# EAGLE design PCB ERC - Control (3-7) (EAGLE 9.7.0)

## Sheet 1 of 2
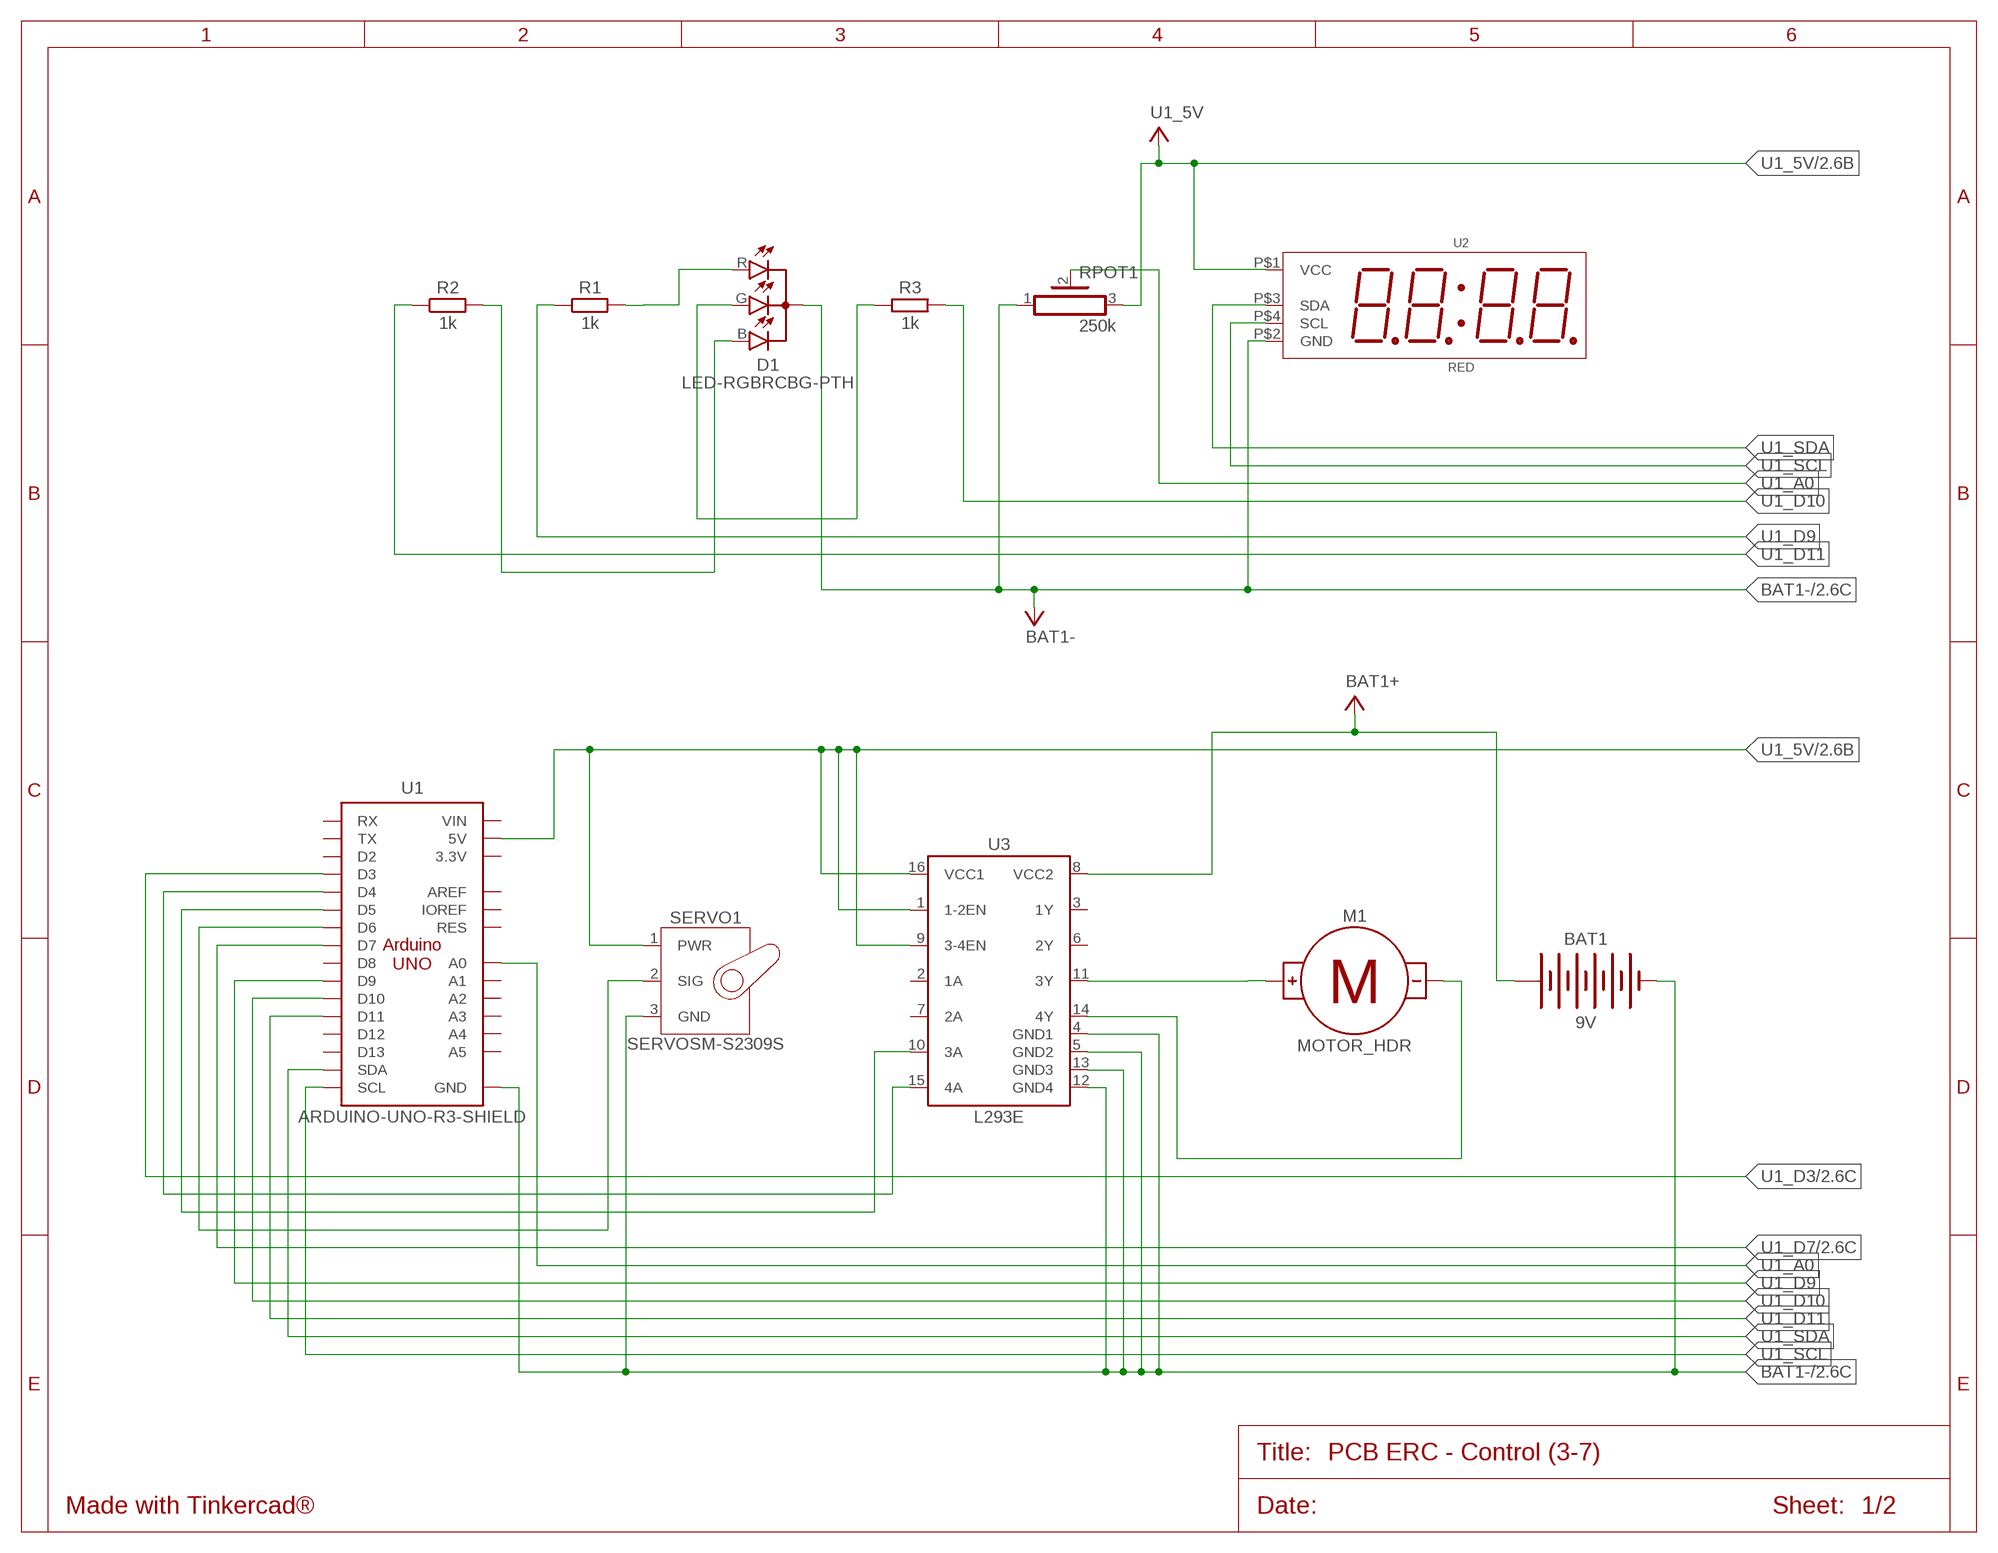
[diagram p0: schematic, sheet 1]

### Parts
BAT1  9V  BATTERY-9VGENERIC  [BATTERY-GENERIC]
D1  LED-RGBRCBG-PTH  [LED-RGB-5MM]
M1  MOTOR_HDR  [MOTOR]
R1  1k  RESISTOR_AXIAL-10.16MM-PITCH  [RESAD1016W63L850D250B]
R2  1k  RESISTOR_AXIAL-10.16MM-PITCH  [RESAD1016W63L850D250B]
R3  1k  RESISTOR_AXIAL-10.16MM-PITCH  [RESAD1016W63L850D250B]
RPOT1  250k  POT_HA-06  [HA-06-SM065]
SERVO1  SERVOSM-S2309S  [SM-S2309S]
U1  ARDUINO-UNO-R3-SHIELD  [ARDUINO-UNO-R3-SHIELD]
U2  RED  7SEG-X4-I2C  [7SEG-X4-I2C]
U3  L293E  [DIP762W53P254L1969H508Q16B]

### Nets
BAT1+: BAT1.+ U3.8(VCC2)
BAT1-: BAT1.- D1.C RPOT1.1 SERVO1.3(GND) U1.GND@0(GND) U1.GND@1(GND) U1.GND@2(GND) U2.P$2(GND) U3.4(GND1) U3.5(GND2) U3.12(GND4) U3.13(GND3) ; also sheet 2
D1_B: D1.B R2.2
D1_G: D1.G R3.2
D1_R: D1.R R1.2
M1_+: M1.+ U3.11(3Y)
M1_-: M1.- U3.14(4Y)
U1_5V: RPOT1.3 SERVO1.1(PWR) U1.5V U2.P$1(VCC) U3.1(1-2EN) U3.9(3-4EN) U3.16(VCC1) ; also sheet 2
U1_A0: RPOT1.2 U1.A0
U1_D3: U1.D3 ; also sheet 2
U1_D4: U1.D4 U3.15(4A)
U1_D5: U1.D5 U3.10(3A)
U1_D6: SERVO1.2(SIG) U1.D6
U1_D7: U1.D7 ; also sheet 2
U1_D9: R1.1 U1.D9
U1_D10: R3.1 U1.D10
U1_D11: R2.1 U1.D11
U1_SCL: U1.SCL U2.P$4(SCL)
U1_SDA: U1.SDA U2.P$3(SDA)
Unconnected: U1.3.3V U1.A1 U1.A2 U1.A3 U1.A4 U1.A5 U1.AREF U1.D2 U1.D8 U1.D12 U1.D13 U1.IOREF U1.RES U1.RX U1.TX U1.VIN U3.2(1A) U3.3(1Y) U3.6(2Y) U3.7(2A)

## Sheet 2 of 2
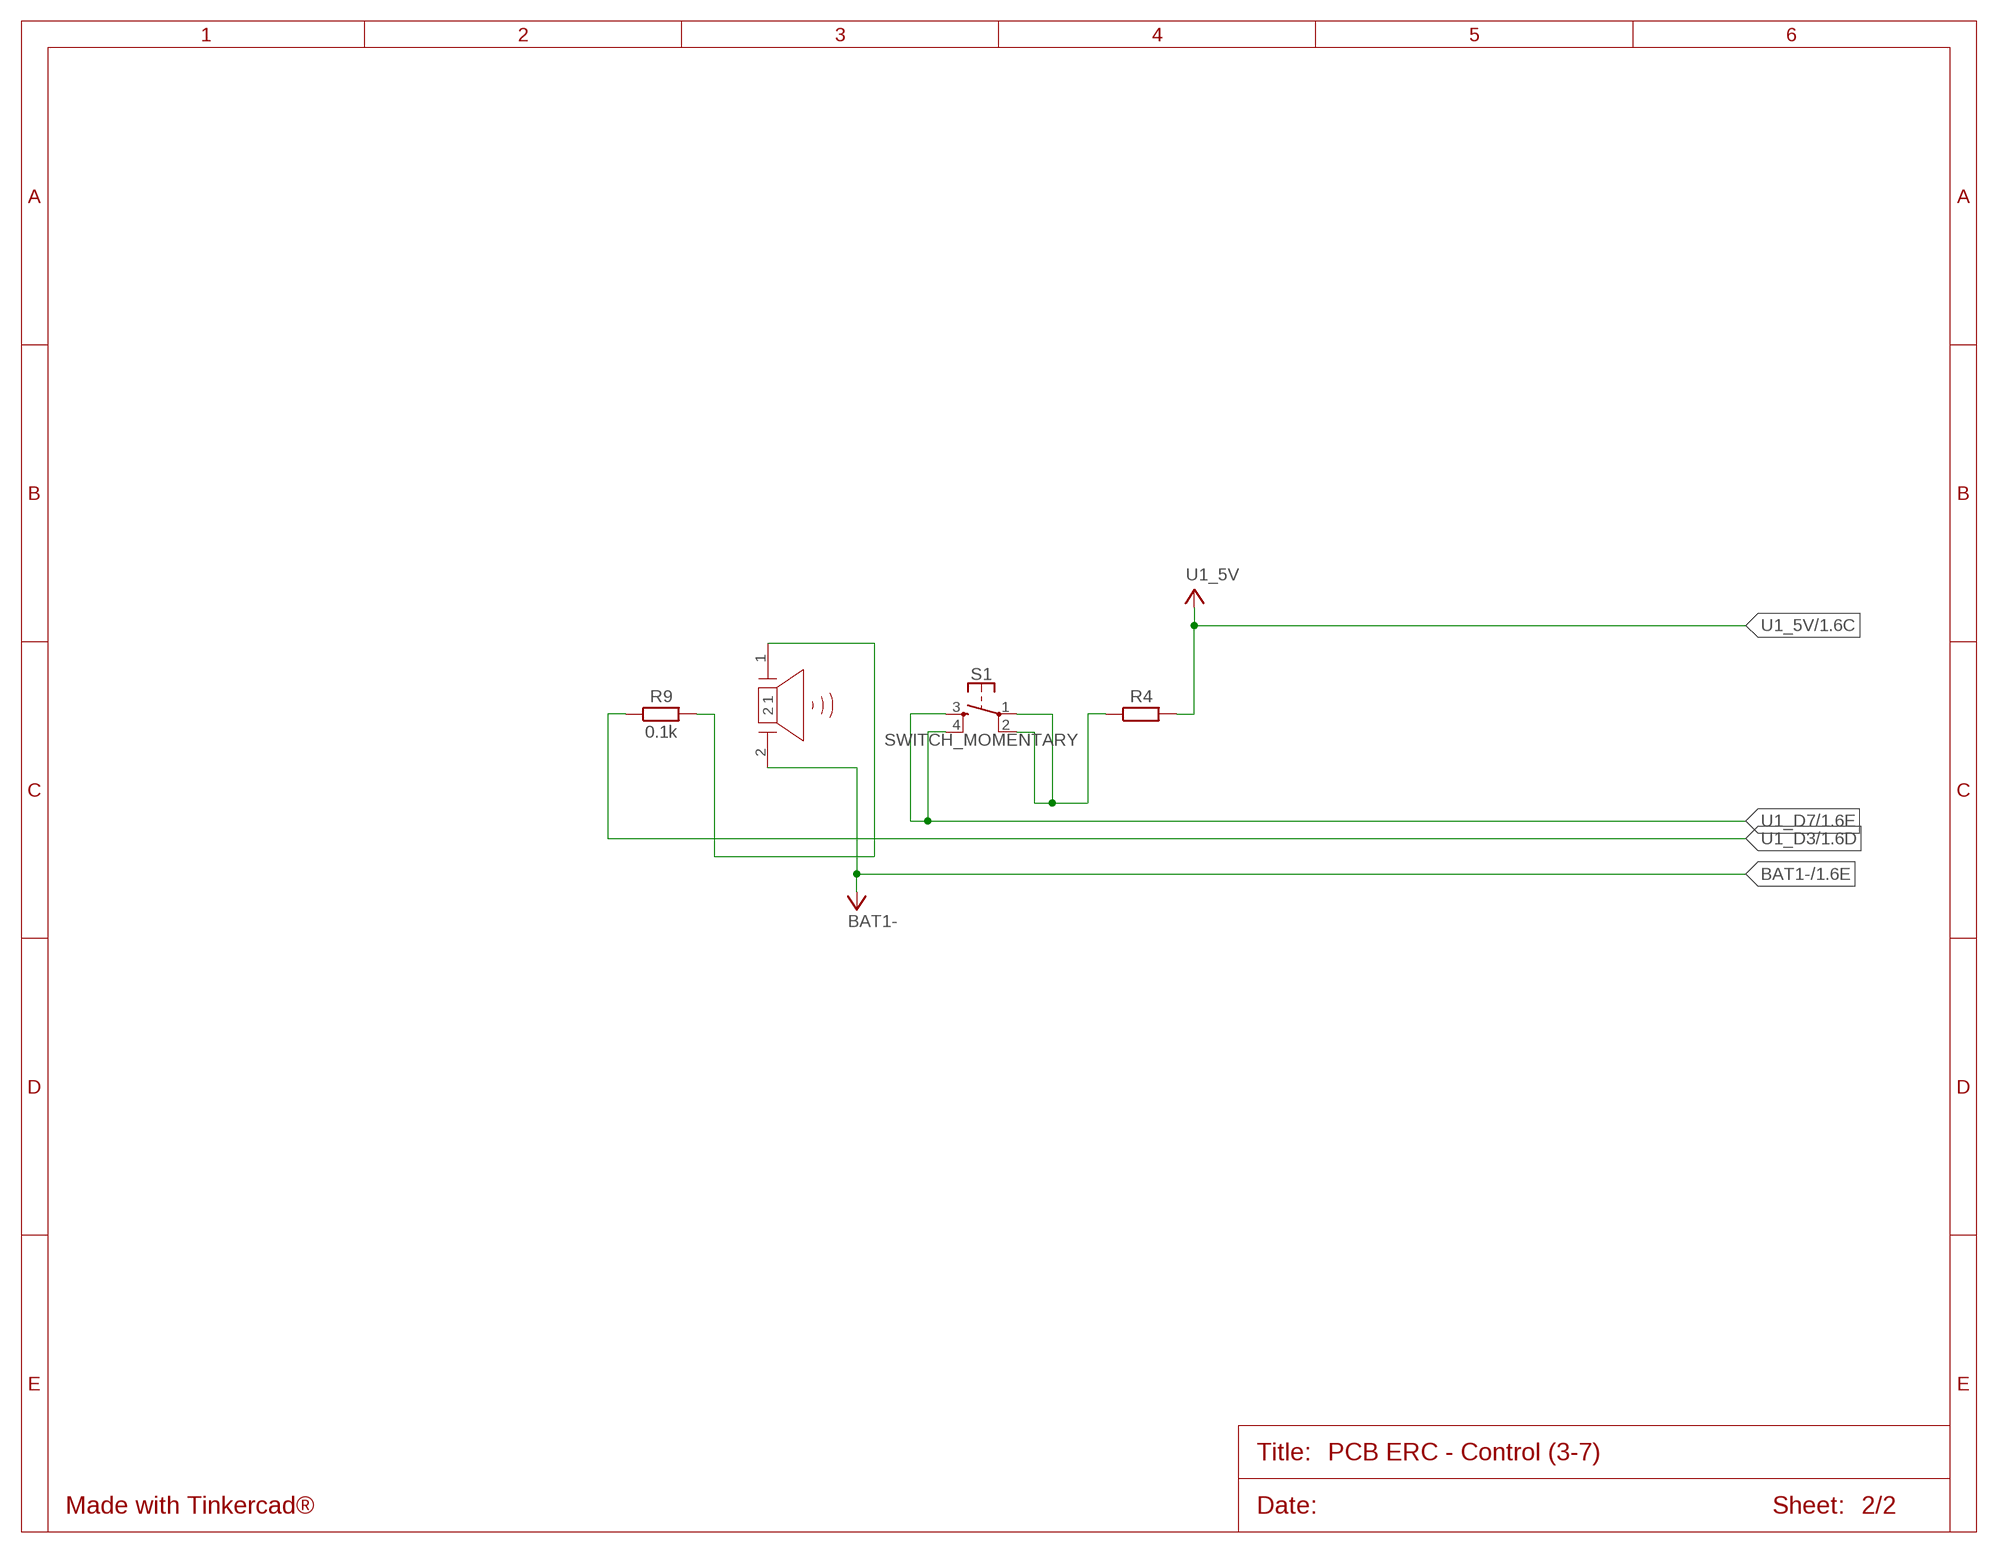
[diagram p1: schematic, sheet 2]

### Parts
PIEZO1  PIEZO  [PIEZO]
R4  RESISTOR_AXIAL-10.16MM-PITCH  [RESAD1016W63L850D250B]
R9  0.1k  RESISTOR_AXIAL-10.16MM-PITCH  [RESAD1016W63L850D250B]
S1  SWITCH_MOMENTARY  [SWITCH-MOMENTARY-PTH-6.5MM]

### Nets
BAT1-: PIEZO1.2 ; also sheet 1
PIEZO1_1: PIEZO1.1 R9.2
S1_1: R4.1 S1.1 S1.2
U1_5V: R4.2 ; also sheet 1
U1_D3: R9.1 ; also sheet 1
U1_D7: S1.3 S1.4 ; also sheet 1

## Library data of the parts
BAT1 = Tinkercad:BATTERY-9V
D1 = Tinkercad:LED-RGB
M1 = Tinkercad:MOTOR
PIEZO1 = Tinkercad:PIEZO: Piezoelectric Sounders / Buzzers Reference Datasheet <https://www.murata.com/products/productdata/8801054621726/SPEC-PKM17EPPH4001-B0.pdf?1517839212000>
R1-R4 R9 = Tinkercad:RESISTOR: Resistor Fixed - Generic
RPOT1 = Tinkercad:POT: Rectangular Trimmer Potentiometers - PV36 Series Datasheet <https://www.bourns.com/docs/Product-Datasheets/pv36.pdf>
S1 = Tinkercad:SWITCH_MOMENTARY
SERVO1 = Tinkercad:SERVO
U1 = Tinkercad:ARDUINO-UNO-R3-SHIELD
U2 = Tinkercad:7SEG-X4-I2C
U3 = Tinkercad:L293E: L293D H-bridge motor driver Datasheet <https://www.ti.com/lit/ds/symlink/l293.pdf>

## Board
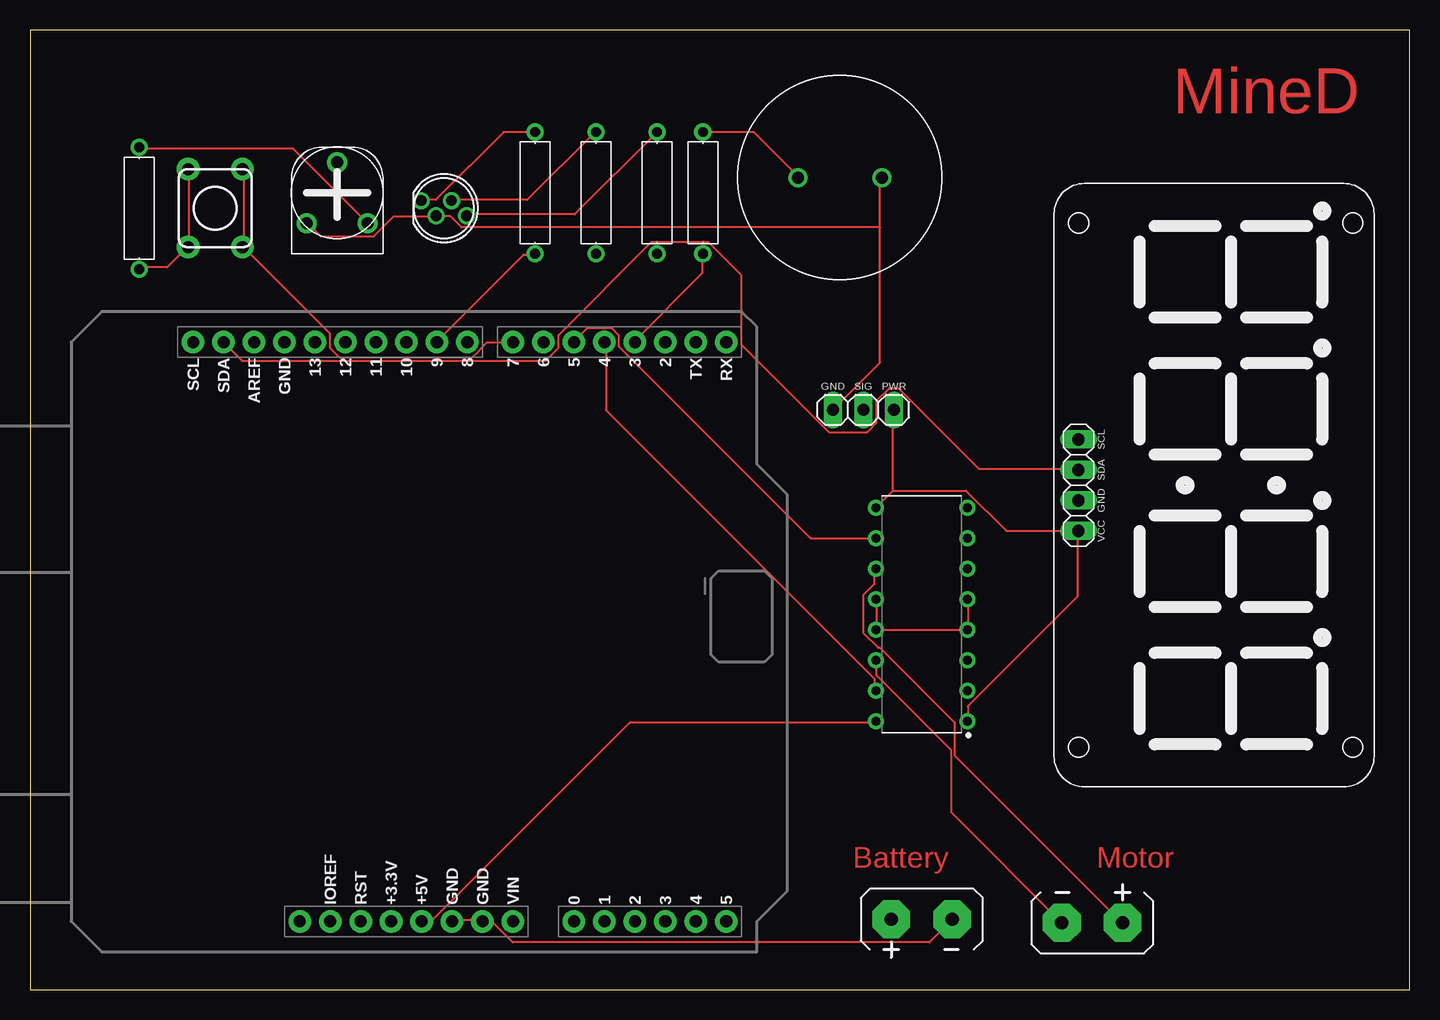
[diagram p2: board, top side]
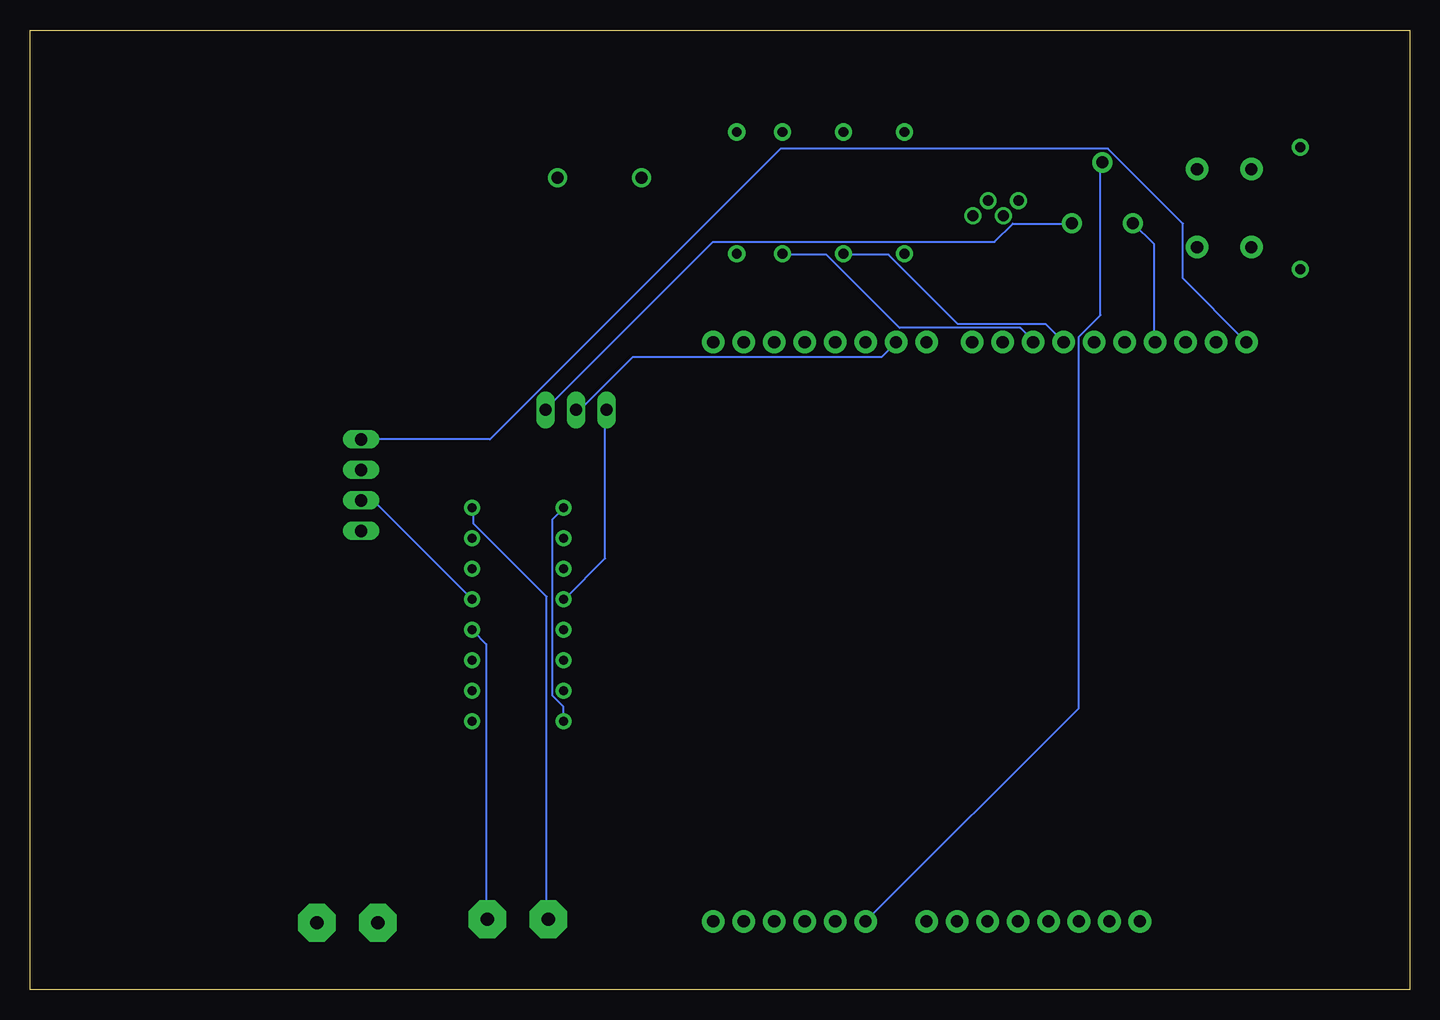
[diagram p3: board, bottom side, seen from below]

Size 115 x 79.99 mm. Coordinates in mm from the lower left corner, seen from the top.
Outline: 0,0 115,0 115,79.99 0,79.99 0,0
Copper layers (1*16): Top / Bottom
Stack-up Default Layer Stack: Top User Defined 0.035mm / Dielectric-1 User Defined 1.5mm / Bottom User Defined 0.035mm
Design rules "default": minimum track width 6mil, minimum drill 0.35mm, track to track 6mil, track to pad 6mil, pad to pad 6mil, via to via 6mil, smd to smd 6mil, copper to edge 40mil, drill to drill 6mil, minimum pad ring 10mil, minimum via ring 8mil, stop-mask expansion 4mil, vias tented up to drill 0mil, thermal gap 10mil

### Footprints (pad centres in the part's own frame; a part is rotated, then mirrored left to right if it is on the bottom)
BATTERY-GENERIC = drill 1.118 pad 3.15 octagon: + 2.54,0; - -2.54,0
LED-RGB-5MM = drill 0.9: B 0.635,0.635; C -0.635,-0.635; G 1.905,-0.635; R -1.905,0.635
MOTOR = drill 1.118 pad 3.15 octagon: + 2.54,0; - -2.54,0
PIEZO = drill 1 pad 1.6: 1 -3.5,0; 2 3.5,0
RESAD1016W63L850D250B = drill 0.83 pad 1.43: 1 -5.08,0; 2 5.08,0
HA-06-SM065 = drill 1 pad 1.676: 1 -2.54,-2.54; 2 0,2.54; 3 2.54,-2.54
SWITCH-MOMENTARY-PTH-6.5MM = drill 1.016 pad 1.88: 1 -3.251,2.261; 2 3.251,2.261; 3 -3.251,-2.261; 4 3.251,-2.261
SM-S2309S = drill 1.016 long: 1 -2.54,0; 2 0,0; 3 2.54,0
ARDUINO-UNO-R3-SHIELD = drill 1.016 pad 1.88: 3.3V 24.13,-2.54; 5V 24.13,0; A0 24.13,12.7; A1 24.13,15.24; A2 24.13,17.78; A3 24.13,20.32; A4 24.13,22.86; A5 24.13,25.4; AREF -24.13,-13.97; D2 -24.13,20.32; D3 -24.13,17.78; D4 -24.13,15.24; D5 -24.13,12.7; D6 -24.13,10.16; D7 -24.13,7.62; D8 -24.13,3.81; D9 -24.13,1.27; D10 -24.13,-1.27; D11 -24.13,-3.81; D12 -24.13,-6.35; D13 -24.13,-8.89; GND@0 24.13,2.54; GND@1 24.13,5.08; GND@2 -24.13,-11.43; IOREF 24.13,-7.62; NC 24.13,-10.16; RES 24.13,-5.08; RX -24.13,25.4; SCL -24.13,-19.05; SDA -24.13,-16.51; TX -24.13,22.86; VIN 24.13,7.62
7SEG-X4-I2C = drill 1.016 long: P$1 -3.81,0; P$2 -1.27,0; P$3 1.27,0; P$4 3.81,0
DIP762W53P254L1969H508Q16B = drill 0.743 pad 1.343: 1 -3.81,8.89; 2 -3.81,6.35; 3 -3.81,3.81; 4 -3.81,1.27; 5 -3.81,-1.27; 6 -3.81,-3.81; 7 -3.81,-6.35; 8 -3.81,-8.89; 9 3.81,-8.89; 10 3.81,-6.35; 11 3.81,-3.81; 12 3.81,-1.27; 13 3.81,1.27; 14 3.81,3.81; 15 3.81,6.35; 16 3.81,8.89

### Placement (x,y rotation side)
BAT1  74.34,5.89 180 top
D1  34.5,65.14 0 top
M1  88.55,5.59 0 top
PIEZO1  67.52,67.68 0 top
R1  42.12,66.41 90 top
R2  47.2,66.41 90 top
R3  52.28,66.41 90 top
R4  9.1,65.14 90 top
R9  56.09,66.41 90 top
RPOT1  25.61,66.41 0 top
S1  15.45,65.14 90 top
SERVO1  69.47,48.33 180 top
U1  32.64,29.84 270 top
U2  87.41,42.06 90 top
U3  74.34,31.29 180 top

### Tracks (layer width: path | path; a pad name or v marks a point on that pad's centre or on a via)
BAT1+
  Bottom 0.152: U3.8 78.03,40.08 78.03,38.86 71.93,32.77 71.93,5.94 BAT1.+
BAT1-
  Top 0.152: U1.GND@0 35.2,5.79 37.64,5.79 U1.GND@1 37.79,5.64 38.56,5.64 40.23,3.96 74.98,3.96 76.81,5.79 BAT1.- | RPOT1.1 23.16,63.86 24.23,62.79 28.65,62.79 30.33,64.47 33.83,64.47 D1.C 33.98,64.47 35.05,64.47 35.97,63.55 70.87,63.55 | U3.5 78.18,32.46 78.18,30.02 U3.4 78.03,30.02 70.56,30.02 | 70.56,30.02 70.56,32.46 U3.12 | 70.87,63.55 70.87,52.27 67.06,48.46 SERVO1.3 | 70.87,63.55 70.87,67.67 PIEZO1.2 | 70.56,30.02 U3.13
  Bottom 0.152: U1.GND@2 21.34,54.1 21.34,62.18 23.01,63.86 RPOT1.1 | U2.P$2 87.33,40.69 86.26,40.69 78.18,32.61 U3.5 | SERVO1.3 67.06,48.31 67.06,35.97 70.41,32.61 U3.12 | BAT1.- 76.96,5.94 76.96,28.8 78.03,29.87 U3.4
D1_B
  Top 0.152: D1.B 35.2,65.84 41.45,65.84 47.09,71.48 R2.2
D1_G
  Top 0.152: D1.G 36.42,64.62 45.41,64.62 52.27,71.48 R3.2
D1_R
  Top 0.152: D1.R 32.61,65.84 33.83,65.84 39.47,71.48 42.06,71.48 R1.2
M1_+
  Top 0.152: U3.11 70.41,35.05 70.41,33.83 69.49,32.92 69.49,29.72 70.71,28.5 70.87,28.5 77.11,22.25 77.11,19.51 90.98,5.64 M1.+
M1_-
  Top 0.152: U3.14 70.56,27.43 70.56,26.21 76.81,19.96 76.81,14.78 85.95,5.64 M1.-
PIEZO1_1
  Top 0.152: R9.2 56.24,71.48 60.35,71.48 64.01,67.82 PIEZO1.1
S1_1
  Top 0.152: R4.1 9.14,60.2 11.43,60.2 13.11,61.87 S1.1 13.26,62.03 13.26,68.28 S1.2
U1_5V
  Top 0.152: R4.2 9.14,70.1 21.95,70.1 28.04,64.01 RPOT1.3 | U3.1 78.18,22.4 78.18,23.62 87.33,32.77 87.33,38.1 U2.P$1 87.33,38.25 81.38,38.25 78.03,41.6 71.93,41.6 | 71.93,41.6 71.93,48.31 SERVO1.1 | 71.93,41.6 70.56,40.23 U3.9 | U1.5V 32.77,5.79 33.53,5.79 49.99,22.25 70.41,22.25 U3.16
  Bottom 0.152: U3.16 70.56,22.4 70.56,23.62 71.48,24.54 71.48,39.17 70.56,40.08 U3.9 | RPOT1.3 28.19,63.86 33.07,63.86 34.59,62.33 58.06,62.33 71.93,48.46 SERVO1.1
U1_A0
  Bottom 0.152: RPOT1.2 25.76,68.89 25.76,56.24 27.58,54.41 27.58,23.47 45.26,5.79 U1.A0
U1_D3
  Top 0.152: R9.1 56.08,61.27 56.08,59.74 50.44,54.1 U1.D3
U1_D4
  Top 0.152: U3.15 70.41,24.99 70.41,25.91 48.01,48.31 48.01,53.95 U1.D4
U1_D5
  Top 0.152: U3.10 70.41,37.64 65.08,37.64 49.07,53.65 49.07,54.56 48.46,55.17 46.48,55.17 45.41,54.1 U1.D5
U1_D6
  Bottom 0.152: SERVO1.2 69.34,48.46 69.04,48.46 64.77,52.73 44.04,52.73 42.82,53.95 U1.D6
U1_D7
  Top 0.152: S1.4 17.83,68.28 17.83,62.03 S1.3 17.83,61.87 24.99,54.71 24.99,53.49 25.76,52.73 36.88,52.73 38.1,53.95 40.23,53.95 U1.D7
U1_D9
  Top 0.152: R1.1 42.06,61.27 41.15,61.27 33.98,54.1 U1.D9
U1_D10
  Bottom 0.152: R3.1 52.27,61.27 48.62,61.27 42.52,55.17 32.46,55.17 31.39,54.1 U1.D10
U1_D11
  Bottom 0.152: R2.1 47.09,61.27 43.43,61.27 37.64,55.47 30.33,55.47 28.96,54.1 U1.D11
U1_SCL
  Bottom 0.152: U2.P$4 87.33,45.87 76.66,45.87 52.43,70.1 25.15,70.1 18.9,63.86 18.9,59.28 13.72,54.1 U1.SCL
U1_SDA
  Top 0.152: U2.P$3 87.33,43.43 79.1,43.43 72.39,50.14 71.63,50.14 70.56,49.07 70.56,47.24 69.8,46.48 66.6,46.48 59.28,53.8 59.28,59.59 56.54,62.33 51.82,62.33 44.04,54.56 44.04,53.49 42.98,52.43 17.68,52.43 16.15,53.95 U1.SDA

### Text on the board
Top: MineD | Battery | Motor